# Altium schematic sheet Wifi.SchDoc
size B; SheetNumber: 15; SheetTotal: 15
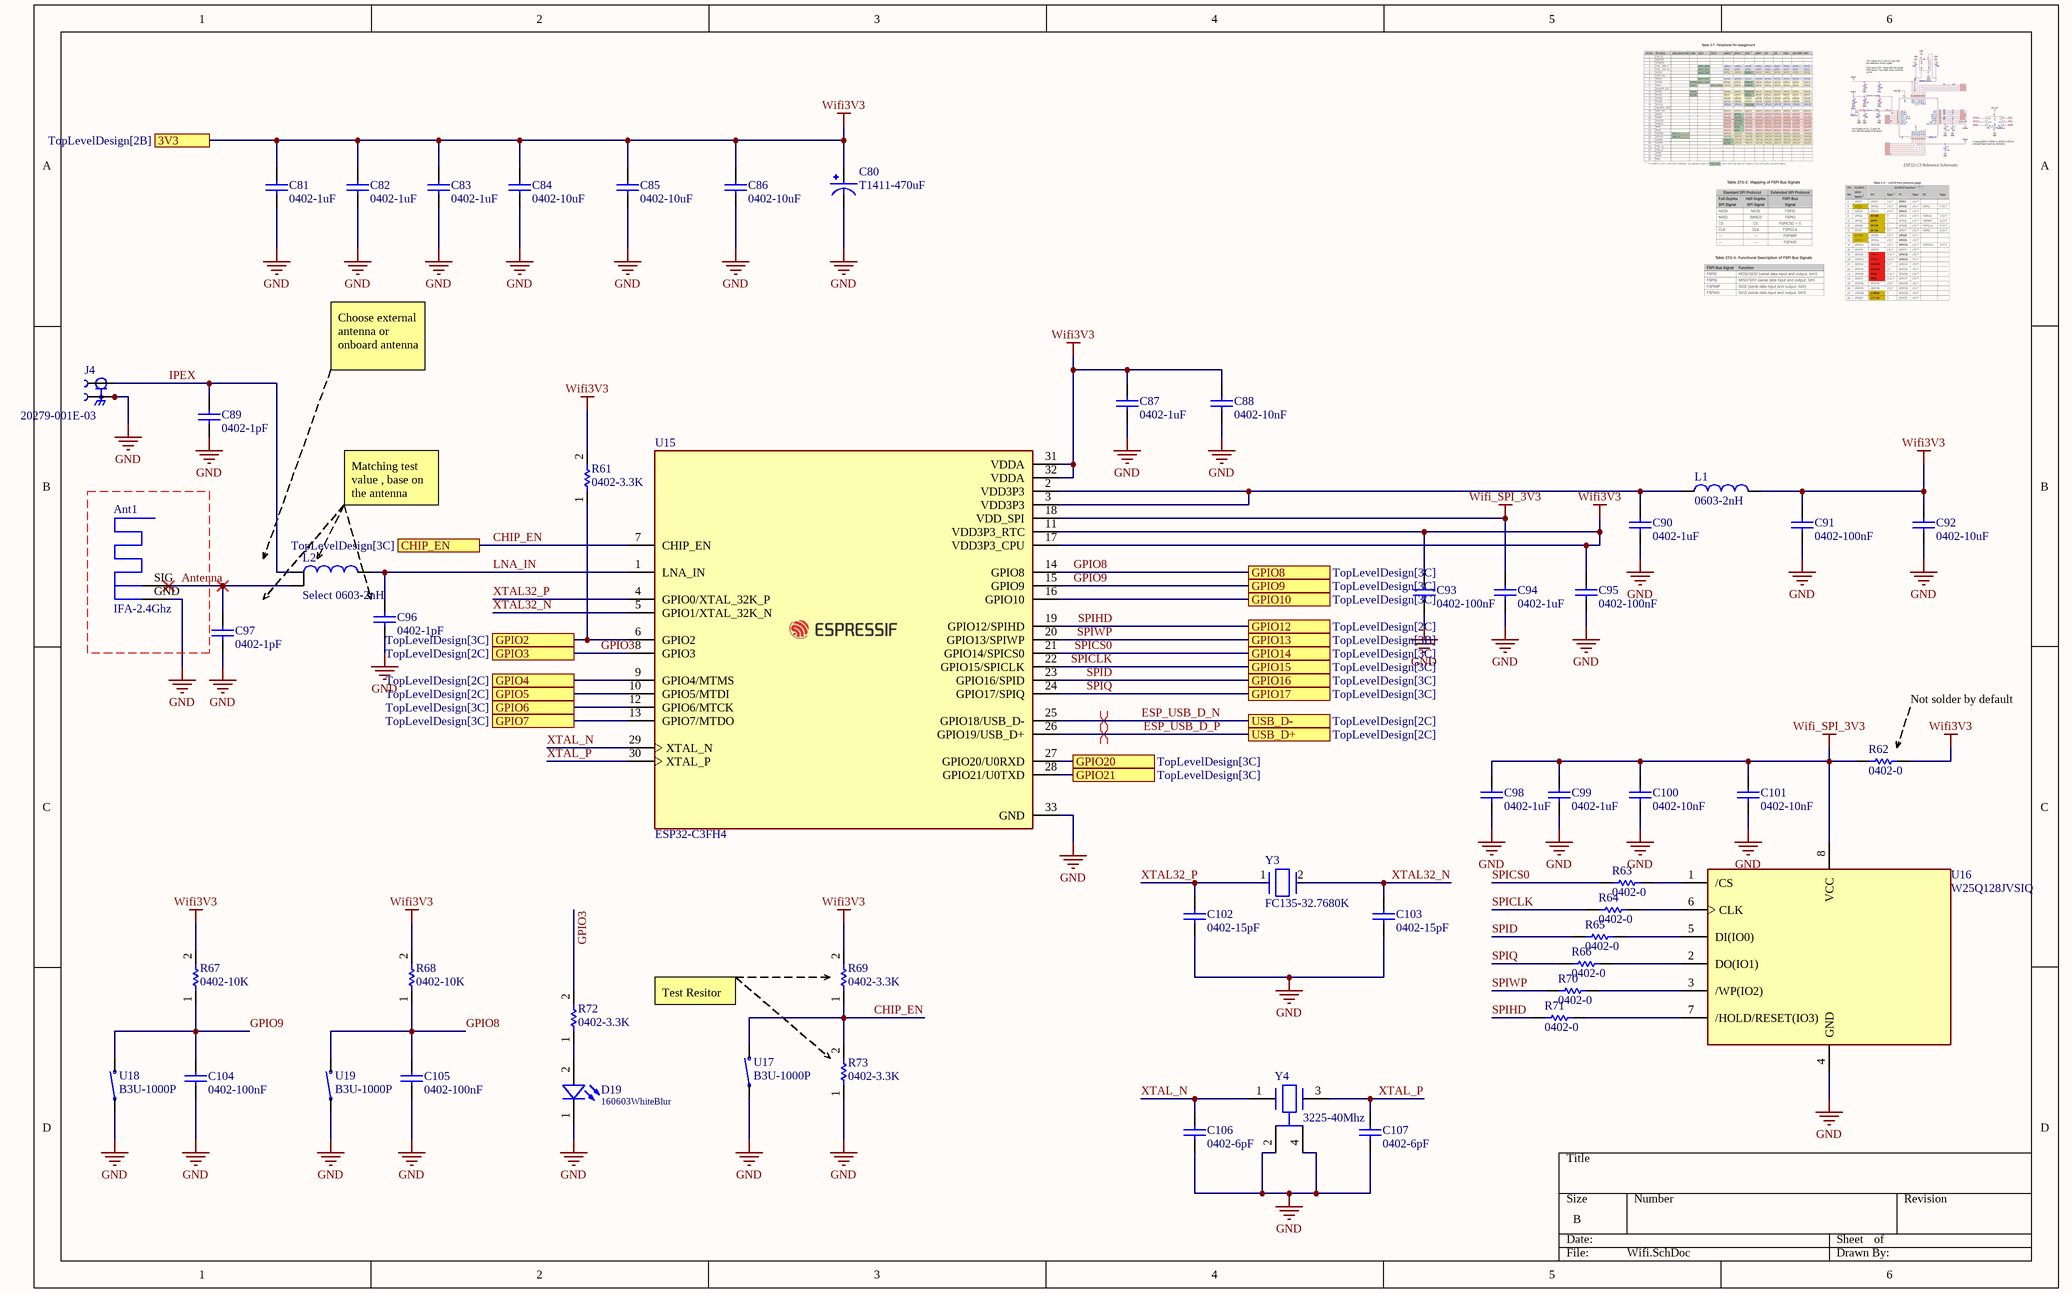
[diagram p0: Wifi.SchDoc]

## Parts
Ant1  IFA-2.4Ghz  [IFA-2.4Ghz-Footprint-1]
C80  T1411-470uF  [CAPPC3528X210N]
C81  0402-1uF  [CAPC0402(1005)60_N]
C82  0402-1uF  [CAPC0402(1005)60_N]
C83  0402-1uF  [CAPC0402(1005)60_N]
C84  0402-10uF  [CAPC0402(1005)60_N]
C85  0402-10uF  [CAPC0402(1005)60_N]
C86  0402-10uF  [CAPC0402(1005)60_N]
C87  0402-1uF  [CAPC0402(1005)60_N]
C88  0402-10nF  [CAPC0402(1005)60_N]
C89  0402-1pF  [CAPC0402(1005)60_N]
C90  0402-1uF  [CAPC0402(1005)60_N]
C91  0402-100nF  [CAPC0402(1005)60_N]
C92  0402-10uF  [CAPC0402(1005)60_N]
C93  0402-100nF  [CAPC0402(1005)60_N]
C94  0402-1uF  [CAPC0402(1005)60_N]
C95  0402-100nF  [CAPC0402(1005)60_N]
C96  0402-1pF  [CAPC0402(1005)60_N]
C97  0402-1pF  [CAPC0402(1005)60_N]
C98  0402-1uF  [CAPC0402(1005)60_N]
C99  0402-1uF  [CAPC0402(1005)60_N]
C100  0402-10nF  [CAPC0402(1005)60_N]
C101  0402-10nF  [CAPC0402(1005)60_N]
C102  0402-15pF  [CAPC0402(1005)60_N]
C103  0402-15pF  [CAPC0402(1005)60_N]
C104  0402-100nF  [CAPC0402(1005)60_N]
C105  0402-100nF  [CAPC0402(1005)60_N]
C106  0402-6pF  [CAPC0402(1005)60_N]
C107  0402-6pF  [CAPC0402(1005)60_N]
D19  160603WhiteBlur  [WL-SMCW_0603_H=0.7mm]
J4  20279-001E-03  [IPEX_20279-001E-03]
L1  0603-2nH  [INDC1608X80N]
L2  Select 0603-2nH  [Copy of INDC1608X80N]
R61  0402-3.3K  [R-0402-10K]
R62  0402-0  [R-0402-1K]
R63  0402-0  [R-0402-1K]
R64  0402-0  [R-0402-1K]
R65  0402-0  [R-0402-1K]
R66  0402-0  [R-0402-1K]
R67  0402-10K  [R-0402-10K]
R68  0402-10K  [R-0402-10K]
R69  0402-3.3K  [R-0402-10K]
R70  0402-0  [R-0402-1K]
R71  0402-0  [R-0402-1K]
R72  0402-3.3K  [R-0402-10K]
R73  0402-3.3K  [R-0402-10K]
U15  ESP32-C3FH4  [QFN50P500X500X90-33N]
U16  W25Q128JVSIQ  [SOIC127P790X216-8N]
U17  B3U-1000P  [SODFL4025X160N]
U18  B3U-1000P  [SODFL4025X160N]
U19  B3U-1000P  [SODFL4025X160N]
Y3  FC135-32.7680K  [FP-FC-135-MFG]
Y4  3225-40Mhz  [FP-NX3225SA-MFG]

## Ports
3V3 (see TopLevelDesign[2B]), CHIP_EN (see TopLevelDesign[3C]), GPIO2 (see TopLevelDesign[3C]), GPIO3 (see TopLevelDesign[2C]), GPIO4 (see TopLevelDesign[2C]), GPIO5 (see TopLevelDesign[2C]), GPIO6 (see TopLevelDesign[3C]), GPIO7 (see TopLevelDesign[3C]), GPIO8 (see TopLevelDesign[3C]), GPIO9 (see TopLevelDesign[3C]), GPIO10 (see TopLevelDesign[3C]), GPIO12 (see TopLevelDesign[2C]), GPIO13 (see TopLevelDesign[3B]), GPIO14 (see TopLevelDesign[3C]), GPIO15 (see TopLevelDesign[3C]), GPIO16 (see TopLevelDesign[3C]), GPIO17 (see TopLevelDesign[3C]), GPIO20 (see TopLevelDesign[3C]), GPIO21 (see TopLevelDesign[3C]), USB_D+ (see TopLevelDesign[2C]), USB_D- (see TopLevelDesign[2C])

## Nets
GND: Ant1.GND C80.2 C81.1 C82.1 C83.1 C84.1 C85.1 C86.1 C87.1 C88.1 C89.1 C90.1 C91.1 C92.1 C93.1 C94.1 C95.1 C96.1 C97.1 C98.1 C99.1 C100.1 C101.1 C102.1 C103.1 C104.1 C105.1 C106.1 C107.1 D19.1(K) J4.2(GROUND) J4.3(GROUND) R73.1 U15.33(GND) U16.4(GND) U17.1 U18.1 U19.1 Y4.2(GND) Y4.4(GND)
Wifi3V3: C80.1 C81.2 C82.2 C83.2 C84.2 C85.2 C86.2 C87.2 C88.2 C91.2 C92.2 C93.2 C95.2 L1.2 R61.2 R62.2 R67.2 R68.2 R69.2 U15.11(VDD3P3_RTC) U15.17(VDD3P3_CPU) U15.31(VDDA) U15.32(VDDA) ; port 3V3
Wifi_SPI_3V3: C94.2 C98.2 C99.2 C100.2 C101.2 R62.1 U15.18(VDD_SPI) U16.8(VCC)
Antenna: Ant1.SIG C97.2 L2.3
CHIP_EN: R69.1 R73.2 U15.7(CHIP_EN) U17.2 ; port CHIP_EN
ESP_USB_D_N: U15.25(GPIO18/USB_D-) ; port USB_D-
ESP_USB_D_P: U15.26(GPIO19/USB_D+) ; port USB_D+
GPIO2: R61.1 U15.6(GPIO2) ; port GPIO2
GPIO3: R72.2 U15.8(GPIO3) ; port GPIO3
GPIO4: U15.9(GPIO4/MTMS) ; port GPIO4
GPIO5: U15.10(GPIO5/MTDI) ; port GPIO5
GPIO6: U15.12(GPIO6/MTCK) ; port GPIO6
GPIO7: U15.13(GPIO7/MTDO) ; port GPIO7
GPIO8: C105.2 R68.1 U15.14(GPIO8) U19.2 ; port GPIO8
GPIO9: C104.2 R67.1 U15.15(GPIO9) U18.2 ; port GPIO9
GPIO10: U15.16(GPIO10) ; port GPIO10
GPIO20: U15.27(GPIO20/U0RXD) ; port GPIO20
GPIO21: U15.28(GPIO21/U0TXD) ; port GPIO21
IPEX: C89.2 J4.1(SIGNAL) L2.1
LNA_IN: C96.2 L2.2 U15.1(LNA_IN)
SPICLK: R64.1 U15.22(GPIO15/SPICLK) ; port GPIO15
SPICS0: R63.1 U15.21(GPIO14/SPICS0) ; port GPIO14
SPID: R65.1 U15.23(GPIO16/SPID) ; port GPIO16
SPIHD: R71.1 U15.19(GPIO12/SPIHD) ; port GPIO12
SPIQ: R66.1 U15.24(GPIO17/SPIQ) ; port GPIO17
SPIWP: R70.1 U15.20(GPIO13/SPIWP) ; port GPIO13
XTAL32_N: C103.2 U15.5(GPIO1/XTAL_32K_N) Y3.2
XTAL32_P: C102.2 U15.4(GPIO0/XTAL_32K_P) Y3.1
XTAL_N: C106.2 U15.29(XTAL_N) Y4.1
XTAL_P: C107.2 U15.30(XTAL_P) Y4.3
NetC90_2: C90.2 L1.1 U15.2(VDD3P3) U15.3(VDD3P3)
NetD19_2: D19.2(A) R72.1
NetR63_2: R63.2 U16.1(/CS)
NetR64_2: R64.2 U16.6(CLK)
NetR65_2: R65.2 U16.5(DI(IO0))
NetR66_2: R66.2 U16.2(DO(IO1))
NetR70_2: R70.2 U16.3(/WP(IO2))
NetR71_2: R71.2 U16.7(/HOLD/RESET(IO3))

## Layout directives
differential pair: ESP_USB_D_N, ESP_USB_D_P

## Notes on the sheet
- Choose external antenna or onboard antenna
- Matching test value , base on the antenna
- Not solder by default
- Test Resitor

## Library data of the parts
Ant1 = CMP-240-000001-3: Antenna Invert F 2.4Ghz; Pin Count: 2; Component Type: Standard; Source: IFA2.4GHZ.SchLib; Design Item ID: IFA-2.4Ghz
C80 = CMP-001-00375-1: 470 µF Molded Tantalum Polymer Capacitor 25 V 1411 (3528 Metric), 1210 150mOhm @ 100kHz; Value: 470µF; MP: TCJB106M025R0150; MF: AVX; SnapEDA_Link: https://www.snapeda.com/parts/TCJB106M025R0150/AVX/view-part/?ref=snap; Check_prices: https://www.snapeda.com/parts/TCJB106M025R0150/AVX/view-part/?ref=eda; Pins: 2; Design Item ID: TCJB106M025R0150; Component Type: Standard; Source: TCJB106M025R0150.SchLib; Case/Package: 1210 AVX
C81-C83 C87 C90 C94 C98 C99 = CMP-001-00353-3: Capacitor 1uF 0402s; Voltage Rating: 4V; Value: 1µF; Tolerance: 20%; Dielectric: X5R; Pins: 2; Component Type: Standard; Packaging: Tape and Reel; Min Operating Temperature: -55°C; Voltage Rating (DC): 4V; Series: M; Height: 0.5mm; RoHS Compliant: Yes; Case/Package: 0402; Thickness: 0.028inch; Design Item ID: CMP-1034-02139-2; Length: 0.039inch; Max Operating Temperature: 85°C; Termination: SMD/SMT; Package Quantity: 1; Width: 0.02inch; Halogen Free: Halogen Free; Source: 0402-10uF.SchLib; Construction: Flat; Mount: Surface Mount; Case Code (Metric): 1005
C84-C86 C92 = CMP-001-00352-3: Capacitor 10uF 0402s; Tolerance: 20%; Value: 10µF; Dielectric: X5R; Voltage Rating (DC): 4V; Width: 0.02inch; Packaging: Tape and Reel; RoHS Compliant: Yes; Series: M; Mount: Surface Mount; Termination: SMD/SMT; Source: 0402-10uF.SchLib; Design Item ID: CMP-1034-02139-2; Min Operating Temperature: -55°C; Construction: Flat; Component Type: Standard; Case Code (Metric): 1005; Length: 0.039inch; Height: 0.5mm; Pins: 2; Thickness: 0.028inch; Voltage Rating: 4V; Package Quantity: 1; Max Operating Temperature: 85°C; Halogen Free: Halogen Free; Case/Package: 0402
C88 C100 C101 = CMP-001-00355-4: Capacitor 10nF 0402; Tolerance: 20%; Dielectric: X5R; Voltage Rating (DC): 4V; Height: 0.5mm; Mount: Surface Mount; Min Operating Temperature: -55°C; Max Operating Temperature: 85°C; RoHS Compliant: Yes; Source: 0402-10uF.SchLib; Width: 0.02inch; Pins: 2; Value: 10nF; Case/Package: 0402; Halogen Free: Halogen Free; Case Code (Metric): 1005; Construction: Flat; Termination: SMD/SMT; Design Item ID: CMP-1034-02139-2; Component Type: Standard; Thickness: 0.028inch; Packaging: Tape and Reel; Series: M; Package Quantity: 1; Length: 0.039inch; Voltage Rating: 4V
C89 C96 C97 = CMP-001-00361-3: Capacitor 1pF 0402; Voltage Rating: 4V; Dielectric: X5R; Tolerance: 20%; Thickness: 0.028inch; Source: 0402-10uF.SchLib; Series: M; Design Item ID: CMP-1034-02139-2; Halogen Free: Halogen Free; RoHS Compliant: Yes; Min Operating Temperature: -55°C; Case Code (Metric): 1005; Voltage Rating (DC): 4V; Value: 1pF; Width: 0.02inch; Max Operating Temperature: 85°C; Pins: 2; Construction: Flat; Mount: Surface Mount; Height: 0.5mm; Termination: SMD/SMT; Package Quantity: 1; Case/Package: 0402; Component Type: Standard; Packaging: Tape and Reel; Length: 0.039inch
C91 C93 C95 C104 C105 = CMP-001-00354-3: Capacitor 100nF 0402; Tolerance: 20%; Voltage Rating (DC): 4V; Dielectric: X5R; Series: M; RoHS Compliant: Yes; Max Operating Temperature: 85°C; Length: 0.039inch; Thickness: 0.028inch; Mount: Surface Mount; Min Operating Temperature: -55°C; Height: 0.5mm; Packaging: Tape and Reel; Construction: Flat; Termination: SMD/SMT; Source: 0402-10uF.SchLib; Design Item ID: CMP-1034-02139-2; Case/Package: 0402; Voltage Rating: 4V; Pins: 2; Value: 100nF; Width: 0.02inch; Component Type: Standard; Package Quantity: 1; Halogen Free: Halogen Free; Case Code (Metric): 1005
C102 C103 = CMP-001-00374-1: Capacitor 15pF 0402; Voltage Rating: 4V; Tolerance: 20%; Dielectric: X5R; Packaging: Tape and Reel; Length: 0.039inch; Max Operating Temperature: 85°C; Design Item ID: CMP-1034-02139-2; Value: 15pF; Min Operating Temperature: -55°C; Case Code (Metric): 1005; Voltage Rating (DC): 4V; Case/Package: 0402; RoHS Compliant: Yes; Height: 0.5mm; Halogen Free: Halogen Free; Construction: Flat; Thickness: 0.028inch; Component Type: Standard; Source: 0402-10uF.SchLib; Termination: SMD/SMT; Mount: Surface Mount; Width: 0.02inch; Pins: 2; Series: M; Package Quantity: 1
C106 C107 = CMP-001-00362-3: Capacitor 6pF 0402; Dielectric: X5R; Voltage Rating: 4V; Tolerance: 20%; Source: 0402-10uF.SchLib; Case Code (Metric): 1005; Case/Package: 0402; Mount: Surface Mount; Component Type: Standard; Packaging: Tape and Reel; Construction: Flat; RoHS Compliant: Yes; Series: M; Width: 0.02inch; Max Operating Temperature: 85°C; Min Operating Temperature: -55°C; Pins: 2; Height: 0.5mm; Package Quantity: 1; Length: 0.039inch; Thickness: 0.028inch; Value: 6pF; Design Item ID: CMP-1034-02139-2; Halogen Free: Halogen Free; Termination: SMD/SMT; Voltage Rating (DC): 4V
D19 = CMP-004-00095-1: WL-SMCW SMT Mono-color Chip LED Blur, size 0603, White; ComponentLink3Description: Supplier 2 URL; Design Item ID: 160603WhiteBlur; Component Type: Standard; Size: 0603; Supplier 1 SN: 755-SMLEN3WBC8W1; Color: White; Supplier 3 Name: ICDayRoi; Supplier 3 URL: N/A; Pins: 2; Supplier 2 URL: https://www.digikey.com/en/products/detail/qt-brightek-qtb/QBLP601-IW/4814655; ComponentLink1URL: N/A; ComponentLink3URL: https://www.digikey.com/en/products/detail/qt-brightek-qtb/QBLP601-IW/4814655; Supplier 1 URL: https://www.mouser.vn/ProductDetail/ROHM-Semiconductor/SMLEN3WBC8W1?qs=W0yvOO0ixfGun78rr9Unsw%3D%3D; ComponentLink2URL: https://www.mouser.vn/ProductDetail/ROHM-Semiconductor/SMLEN3WBC8W1?qs=W0yvOO0ixfGun78rr9Unsw%3D%3D; ComponentLink4Description: Supplier 3 URL; Supplier 1 Name: Mouser; Supplier 3 SN: N/A; ComponentLink4URL: N/A; Source: WL-SMCW_0603.SchLib; Supplier 2 SN: 1516-1057-2-ND; Value: White; Supplier 2 Name: Digi-Key; ComponentLink2Description: Supplier 1 URL; ComponentLink1Description: Datasheet link; Type: Blur
J4 = CMP-002-01573-1: 1 POS Vertical SMD Small form factor with big performance through 6 GHz connector,MHF, RF, micro-coaxial MHF I Receptacle; MF: I-PEX; Value: *; Source: 20279-001E-03.SchLib; Component Type: Standard; Design Item ID: 20279-001E-03; Pins: 3; Check_prices: https://www.snapeda.com/parts/20279-001E-03/I-PEX/view-part/?ref=eda; SnapEDA_Link: https://www.snapeda.com/parts/20279-001E-03/I-PEX/view-part/?ref=snap; Case/Package: None; MP: 20279-001E-03
L1 = CMP-006-00351-2: Value: 2nH; Case/Package: None; Availability: Unavailable; Component Type: Standard; ComponentLink2Description: Website Link; MP: DFE18SBN1R0ME0L; Price: None; Source: DFE18SBN1R0ME0L.SchLib; Design Item ID: DFE18SBN1R0ME0L; ComponentLink1Description: Datasheet Link; Pins: 2
L2 = CMP-006-00364-1: 0603-2nH Selected; Value: 2nH; Component Type: Standard; Source: DFE18SBN1R0ME0L.SchLib; ComponentLink2Description: Website Link; ComponentLink1Description: Datasheet Link; MP: DFE18SBN1R0ME0L; Price: None; Pins: 2; Case/Package: None; Design Item ID: DFE18SBN1R0ME0L; Availability: Unavailable
R61 R69 R72 R73 = CMP-009-00688-1: RES 0402 3.3K; Value: 3.3k
R62-R66 R70 R71 = CMP-009-00678-4: 0402Resistor 0 Ohm; Value: 0
R67 R68 = CMP-009-00675-4: RES 0402 10K; Value: 10k
U15 = CMP-031-00018-2: Design Item ID: ESP32-C3FH4; Value: *; Component Type: Standard; MP: ESP32-C3FH4; Source: ESP32-C3FH4.SchLib; Case/Package: None; Price: None; Availability: Unavailable; Pins: 33
U16 = CMP-031-00021-3: FLASH - NOR Memory IC 128Mb (16M x 8) SPI - Quad I/O, QPI, DTR 133 MHz 8-SOIC; MF: Winbond Electronics; Design Item ID: W25Q128JVSIQ; Case/Package: SOIC-8 Winbond Electronics; Component Type: Standard; MP: W25Q128JVSIQ; Check_prices: https://www.snapeda.com/parts/W25Q128JVSIQ/Winbond/view-part/?ref=eda; SnapEDA_Link: https://www.snapeda.com/parts/W25Q128JVSIQ/Winbond/view-part/?ref=snap; Source: W25Q128JVSIQ.SchLib; Value: *; Pins: 8
U17-U19 = CMP-011-00123-3: Switch Tactile N.O. SPST Round Button Gull Wing 0.05A 12VDC 1.5N SMD T/R; MP: B3U1000P; MF: Omron; Design Item ID: B3U-1000P; Value: *; Component Type: Standard; Check_prices: https://www.snapeda.com/parts/B3U1000P/Omron/view-part/?ref=eda; SnapEDA_Link: https://www.snapeda.com/parts/B3U1000P/Omron/view-part/?ref=snap; Pins: 2; Case/Package: None; Source: B3U-1000P.SchLib
Y3 = CMP-003-00053-1: Parallel - Fundamental Quartz Crystal, 0.032768MHz Nom; Frequency Stability: 0.0144%; Load Capacitance: 12.5pF; Frequency Tolerance: 20ppm; Min Operating Temperature: -40°C; Max Operating Temperature: 85°C
Y4 = CMP-003-00058-1: CRYSTAL 40MHZ 8PF SMD; Manufacturer: NDK; Manufacturer Part Number: NX3225SA-25.000M-STD-CRS-2; Tolerance: 15ppm; Automotive Grade: Grade 1; Esr: 100; Series: NX3225SA; RoHS: TRUE; Pins: 4; Load Capacitance: 8pF; Digikey Description: CRYSTAL 40MHZ 8PF SMD; Device Class L2: Crystals / Oscillators; Category: Crys; Component Type: Standard; Case/Package: NX3225SA; Height: 0.6mm; Frequency: 40MHz; Octopart: https://octopart.com/nx3225sa-25.000m-std-crs-2-ndk-51374293; Temperature: -40°C to +125°C; Temperature Range High: 125°C; Source: Components - 28.03.25 - 23.15.SchLib; Design Item ID: CMP-200220-000002-1; Device Class L1: Passive Components; Temperature Range Low: -40°C; Device Class L3: Crystals; Automotive: Yes; Lead Free: Yes